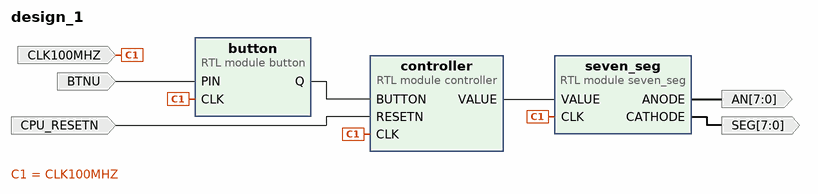
[diagram p0: block diagram of the top level]
# Vivado block design design_1, xc7a100tcsg324-1, Vivado 2021.2
create_bd_design design_1

create_bd_port -dir I -type rst CPU_RESETN
create_bd_port -dir I -type clk CLK100MHZ
create_bd_port -dir I BTNU
create_bd_port -dir O -from 7 -to 0 SEG
create_bd_port -dir O -from 7 -to 0 AN

create_bd_cell -type module -reference button button
create_bd_cell -type module -reference controller controller
create_bd_cell -type module -reference seven_seg seven_seg
set_property -dict {CONFIG.STYLE 1} [get_bd_cells seven_seg]

# ---- connections ----

connect_bd_net -net CLK_0_1 [get_bd_ports CLK100MHZ] [get_bd_pins button/CLK] [get_bd_pins controller/CLK] [get_bd_pins seven_seg/CLK]
connect_bd_net -net PIN_0_1 [get_bd_ports BTNU] [get_bd_pins button/PIN]
connect_bd_net -net RESETN_0_1 [get_bd_ports CPU_RESETN] [get_bd_pins controller/RESETN]
connect_bd_net [get_bd_pins button/Q] [get_bd_pins controller/BUTTON]
connect_bd_net -net controller_0_VALUE [get_bd_pins controller/VALUE] [get_bd_pins seven_seg/VALUE]
connect_bd_net [get_bd_pins seven_seg/ANODE] [get_bd_ports AN]
connect_bd_net [get_bd_pins seven_seg/CATHODE] [get_bd_ports SEG]

validate_bd_design
save_bd_design
